# EAGLE design RB01 (EAGLE 6.3)
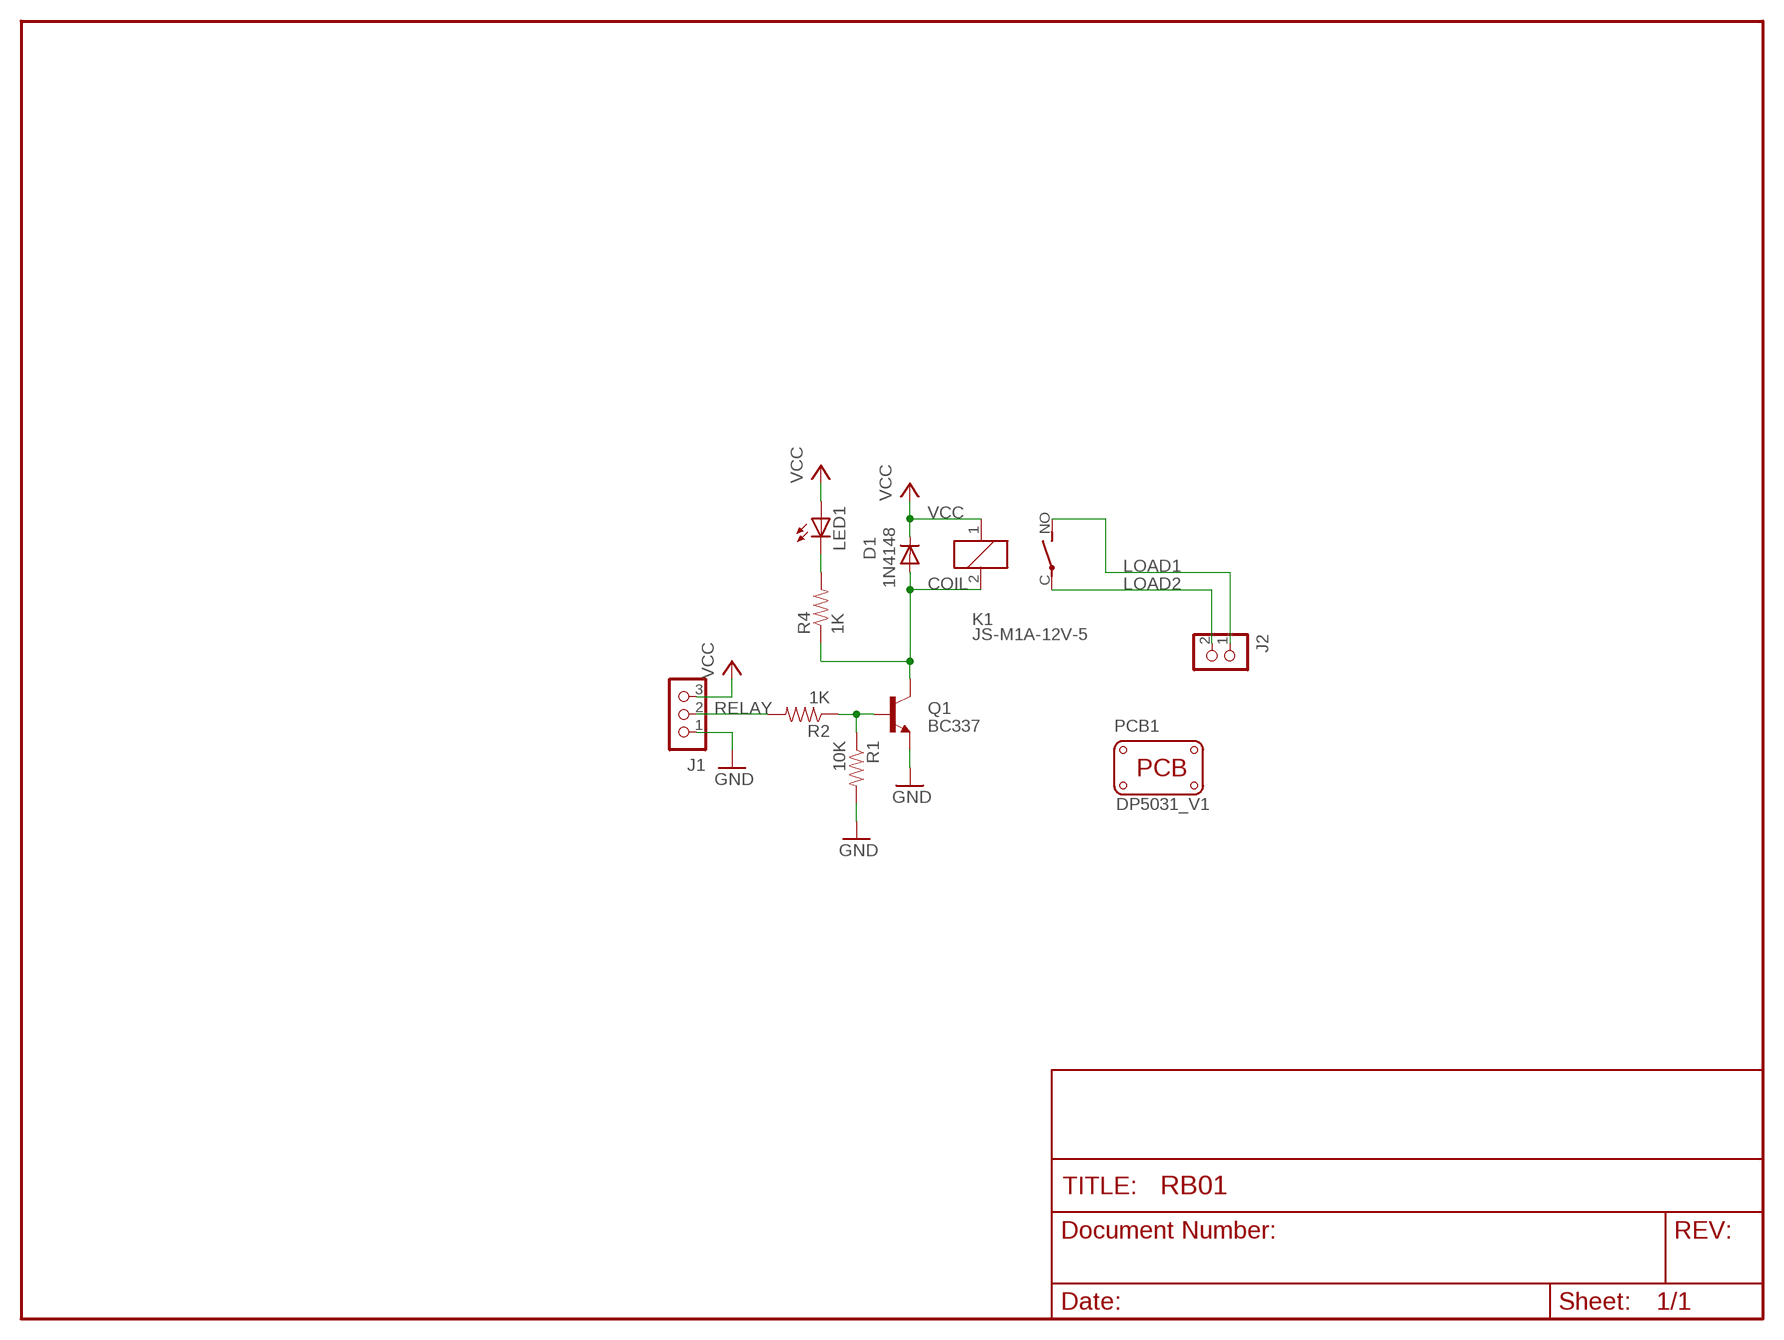
[diagram p0: schematic, sheet 1]

## Parts
D1  1N4148  DIODE1N4148  [DIODE-1N4148]
J1  CON_TERMINAL_BLOCK_03-5MM  [TERMINAL_BLOCK_3P_5]
J2  CON_TERMINAL_BLOCK_02-5MM  [TERMINAL_BLOCK_2P_5]
K1  JS-M1A-12V-5  [JS-M1A]
LED1  LED5MM  [LED5MM]
PCB1  PCB_DP_RECTANGLE-31X50  [DP5031_V1]
Q1  BC337  [TO92]
R1  10K  RESISTORAXIAL-0.3  [AXIAL-0.3]
R2  1K  RESISTORAXIAL-0.3  [AXIAL-0.3]
R4  1K  RESISTORAXIAL-0.3  [AXIAL-0.3]

## Nets
COIL: D1.A K1.2 Q1.3(C) R4.P$1
GND: J1.1 Q1.1(E) R1.P$2
LOAD1: J2.1 K1.NO(2:S)
LOAD2: J2.2 K1.C(2:P)
N$6: Q1.2(B) R1.P$1 R2.P$1
N$9: LED1.K(C) R4.P$2
RELAY: J1.2 R2.P$2
VCC: D1.C J1.3 K1.1 LED1.A

## Library data of the parts
D1 = SparkFun:DIODE: Diode These are standard reverse protection diodes and small signal diodes. SMA package can handle up to about 1A. SOD-323 can handle about 200mA. What the SOD-323 package when ordering, there are some mfgs out there that are 5-pin packages.
J1 = dp_devices:CON_TERMINAL_BLOCK_03: 3 poles, wire to board connector
J2 = dp_devices:CON_TERMINAL_BLOCK_02: 2 poles wire to board terminal block
K1 = relay:JS-M1A*: Automotive Ultra-Miniature Power Relay NAiS Source: http://www.mew-europe.com/.. en_ds_61211_0000.pdf; MPN: JSM1A-12V-5; OC_FARNELL: unknown; OC_NEWARK: 13P4555
LED1 = SparkFun:LED: LEDs Standard schematic elements and footprints for 5mm, 3mm, 1206, and 0603 sized LEDs. 5mm - Spark Fun Electronics SKU : COM-00529 (and others)
PCB1 = dp_devices:PCB_DP_RECTANGLE: Dangerous Prototypes Standard Rectangular PCB sizes; PCB_SIZE: DP5031_V1
Q1 = transistor:BC337: NPN TRANSISTOR
R1 R2 R4 = SparkFun:RESISTOR: Resistor Basic schematic elements and footprints for 0603, 1206, and PTH resistors.

## Board
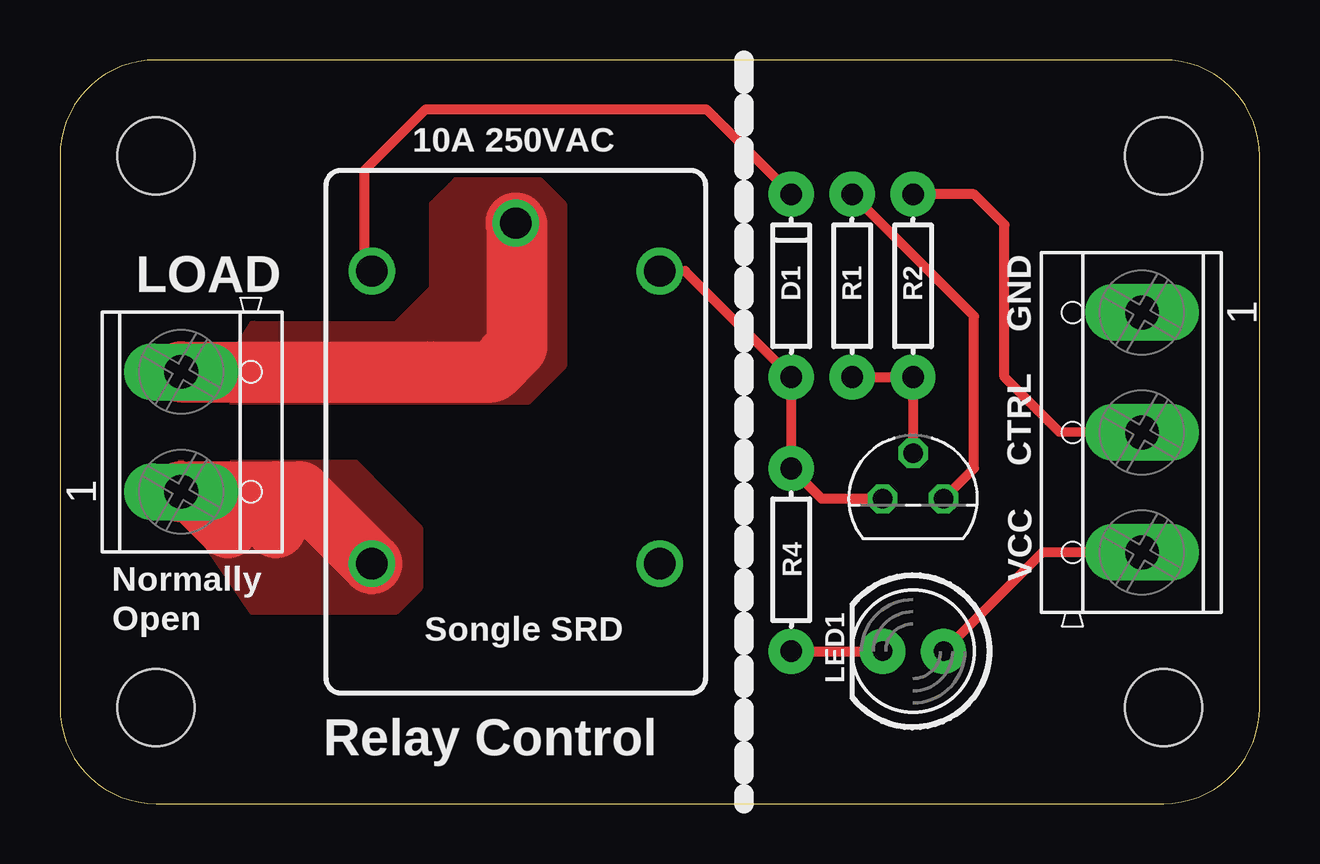
[diagram p1: board, top side]
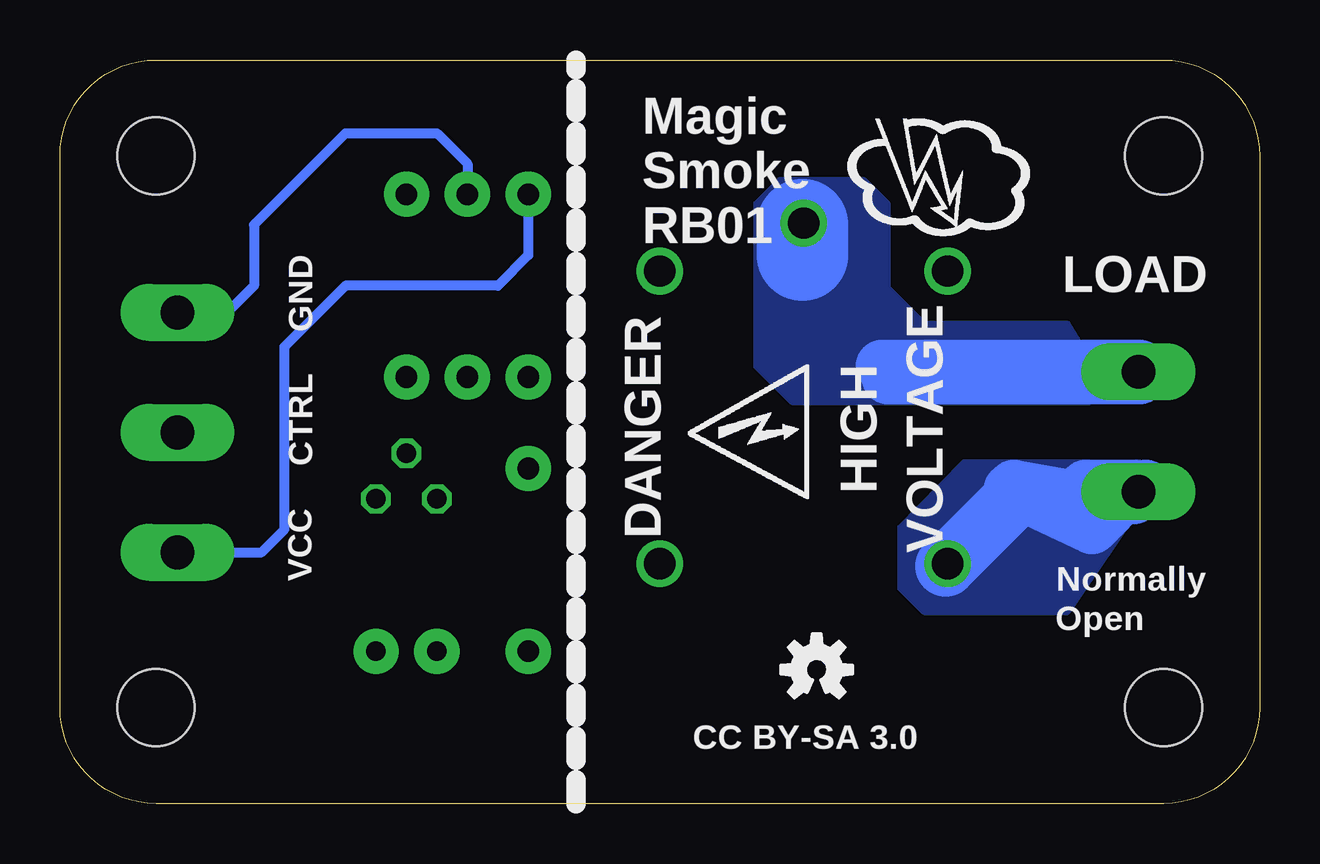
[diagram p2: board, bottom side, seen from below]

Size 50 x 31 mm. Coordinates in mm from the lower left corner, seen from the top.
Copper layers (1*2*15*16): Top 0.035mm / dielectric 0.2mm / Route2 0.0175mm / dielectric 1.1mm / Route15 0.0175mm / dielectric 0.2mm / Bottom 0.035mm
Design rules "SeeedStudio_DRU_no_angle_20130527": minimum track width 6mil, minimum drill 12mil, track to track 6mil, track to pad 6mil, pad to pad 6mil, via to via 6mil, smd to smd 0mil, copper to edge 10mil, drill to drill 10mil, minimum pad ring 6mil, minimum via ring 6mil, stop-mask expansion 2mil, vias tented up to drill 25mil, thermal gap 10mil

### Footprints (pad centres in the part's own frame; a part is rotated, then mirrored left to right if it is on the bottom)
DIODE-1N4148 = drill 0.9 pad 1.88: A -3.81,0; C 3.81,0
TERMINAL_BLOCK_3P_5 = drill 1.4 pad 2.38 long: 1 5,-0.45; 2 0,-0.45; 3 -5,-0.45
TERMINAL_BLOCK_2P_5 = drill 1.4 pad 2.38 long: 1 2.5,-0.45; 2 -2.5,-0.45
JS-M = drill 1.3: 1 6.7,6; 2 6.7,-6; C 8.7,0; NC -5.5,-6; NO -5.5,6
LED5MM = drill 0.813 pad 1.88: A -1.27,0; K 1.27,0
DP5031_V1 = hole 3.2: 4,4; 46,4; 46,27; 4,27
TO92 = drill 0.813 octagon: 1 1.27,0; 2 0,1.905; 3 -1.27,0
AXIAL-0.3 = drill 0.9 pad 1.88: P$1 -3.81,0; P$2 3.81,0

### Placement (x,y rotation side)
D1  30.48,21.59 90 top
J1  44.65,15.47 90 top
J2  5.5,15.5 270 top
K1  JS-M1-12V-5  [JS-M]  19,15.5 90 top
LED1  35.56,6.35 180 top
PCB1  0,0 0 top
Q1  35.56,12.7 0 top
R1  33.02,21.59 90 top
R2  35.56,21.59 90 top
R4  30.48,10.16 270 top
U$2  [OSHW-LOGO-S]  18.46,5.58 0 bottom

### Tracks (layer width: path | path; a pad name or v marks a point on that pad's centre or on a via)
COIL
  Top 0.406: Q1.3 31.75,12.7 R4.P$1 D1.A 26.06,22.2 K1.2
GND
  Top 0.406: Q1.1 38.1,13.97 38.1,20.32 R1.P$2
  Bottom 0.406: J1.1 44.45,20.32 43.18,20.32 41.91,21.59 41.91,24.13 38.1,27.94 34.29,27.94 33.02,26.67 R1.P$2
LOAD1
  Top 2.54: J2.1 7,13 5.5,13 7,11.5 6,13 10,13 | 10,13 9,12 9,11.5 9,13 10,13 | 10,13 K1.NO
  Bottom 2.184: 5.08,13.08 4.75,13.25 5.25,12.75 6.5,12.75 | 6.5,12.75 6.5,12.5 | 6.5,12.5 7.5,12.75 7.25,13 5,13 | 5,13 5.25,13.25 7.5,13 7.25,13.25 5.5,13.25 5.5,13 6.5,13 6.5,12.75 | 6.5,12.5 6,12.5 10.25,13.25 10.41,13.09 7,11.5 5.41,13.09 5,13.09 5,13 | 5,13 10.41,12.58
  Bottom 2.54: 10.41,12.58 13.08,9.91
  pour Top: 12.32,14.22 12.33,14.22 15,11.5 15,9 14,8 8,8 3.75,14.25
  pour Bottom: 12.32,14.22 12.33,14.22 15,11.5 15,9 14,8 8,8 3.75,14.25
LOAD2
  Top 2.54: J2.2 15.46,18 18,18 19.05,19.05 19.05,21.59 19.05,24.15 K1.C
  Bottom 2.184: 5.08,18.03 15.22,18.03 15.5,17.75 5,17.75 15.25,17.75 15.75,18.25 5,18.25 15.49,18.03
  Bottom 3.81: 19.05,24.13 19.05,22.86
  pour Top: 6.75,17.97 8,20 arc-60 8.1,20 14,20 15.5,21.5 15.5,25 16.5,26 20,26 21,25 21,18.25 19.5,16.75 6.25,16.75 6,17 11.5,17 12,17.5
  pour Bottom: 6.75,17.97 8,20 arc-60 8.1,20 14,20 15.5,21.5 15.5,25 16.5,26 20,26 21,25 21,18.25 19.5,16.75 6.25,16.75
N$6
  Top 0.406: R1.P$1 R2.P$1 Q1.2
N$9
  Top 0.406: R4.P$2 LED1.K
RELAY
  Top 0.406: J1.2 41.66,15.49 39.37,17.78 39.37,24.13 38.1,25.4 R2.P$2
VCC
  Top 0.406: K1.1 13,22.56 12.7,22.86 12.7,26.4 15.24,28.94 26.94,28.94 D1.C | LED1.A 40.95,10.47 J1.3
  Bottom 0.406: D1.C 30.48,22.86 31.75,21.59 38.1,21.59 40.64,19.05 40.64,11.43 41.6,10.47 J1.3

### Text on the board
tPlace: 10A 250VAC | LOAD | GND | CTRL | Normally | VCC | Open | Songle SRD | Relay Control
bPlace: Magic / Smoke / RB01 | LOAD | VOLTAGE | DANGER | GND | HIGH | CTRL | Normally | VCC | Open | CC BY-SA 3.0
200bmp: /Users/thomasprice/Documents/eagle/logo/Magic_Smoke_logo.bmp